# Altium project MiniPC MB GOST.PrjPcb (part 31 of 31)

## Sheet P_JTAG_EEPROM.SchDoc
size 420 x 297 mm; Author: ALTIUM GOSTBOM2.0 KEV; SheetNumber: 23; SheetTotal: 48
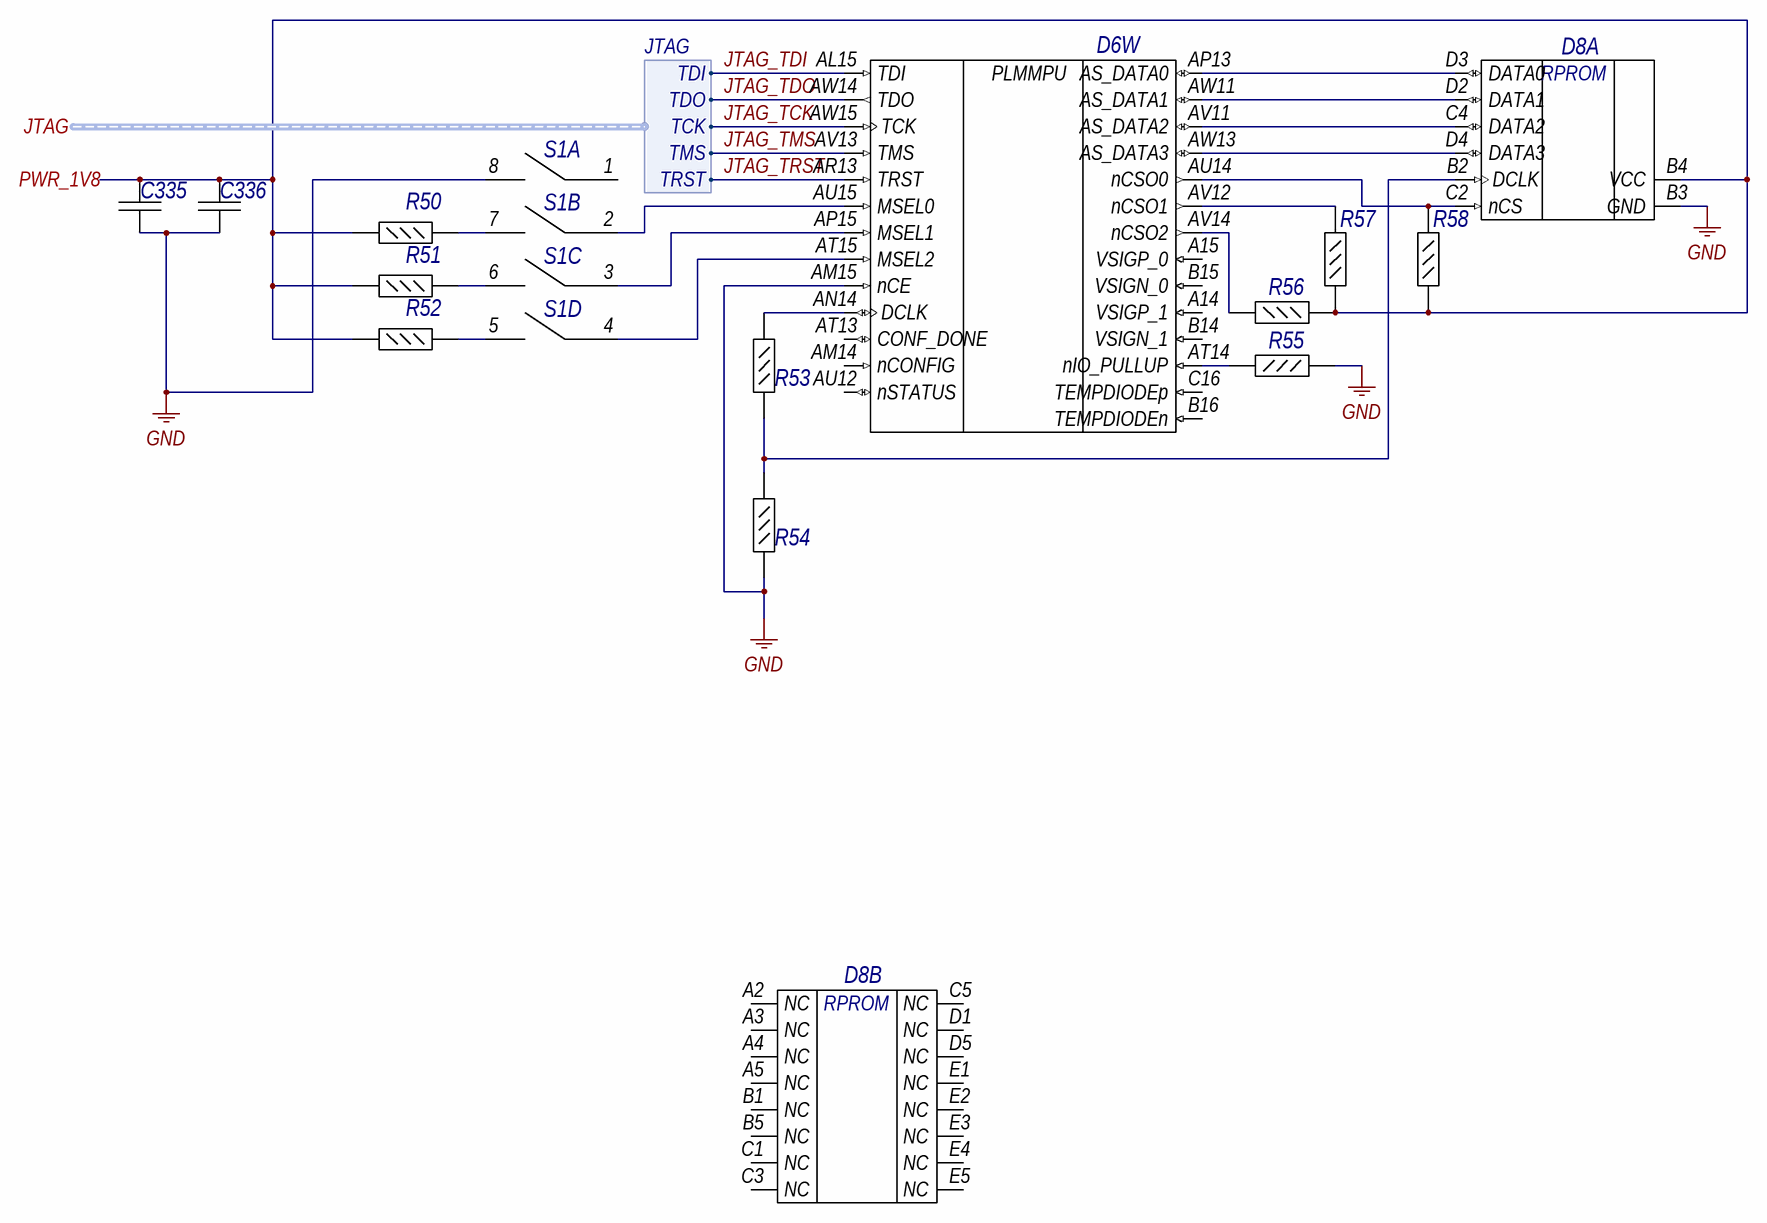
[diagram p40: P_JTAG_EEPROM.SchDoc]

### Parts
C335  C1005X7R1E104M  [CAPC1005X55X10LL05]  (value not drawn)
C336  C1005X7R1E104M  [CAPC1005X55X10LL05]  (value not drawn)
D6  10AS066N3F40E2SGE2  [ALTR-FBGA1517_A-350]  (value not drawn)  (part W of 39)
D8  EPCQL1024F24IN  [ALTR-FBGA24_A-130]  (value not drawn)  (parts A,B of 2)
R50  ERJ-2RKF1001X  [RESC1005X40X25LL05T05]  (value not drawn)
R51  ERJ-2RKF1001X  [RESC1005X40X25LL05T05]  (value not drawn)
R52  ERJ-2RKF1001X  [RESC1005X40X25LL05T05]  (value not drawn)
R53  ERJ-2RKF1002X  [RESC1005X40X25LL05T05]  (value not drawn)
R54  ERJ-2RKF1002X  [RESC1005X40X25LL05T05]  (value not drawn)
R55  ERJ-2GE0R00X  [RESC1005X40X25LL05T05]  (value not drawn)
R56  ERJ-2RKF1002X  [RESC1005X40X25LL05T05]  (value not drawn)
R57  ERJ-2RKF1002X  [RESC1005X40X25LL05T05]  (value not drawn)
R58  ERJ-2RKF1002X  [RESC1005X40X25LL05T05]  (value not drawn)
S1  416131160804  [416131160804]  (value not drawn)  (parts A,B,C,D of 4)

### Ports
JTAG (harness JTAG), PWR_1V8

### Harnesses
JTAG: TCK, TDO, TMS, TRST, TDI

### Nets
GND: C335.1 C336.1 D6.AM15(nCE) D8.B3(GND) R54.1 R55.1 S1.8
JTAG_TCK: D6.AW15(TCK) ; port JTAG.TCK
JTAG_TDI: D6.AL15(TDI) ; port JTAG.TDI
JTAG_TDO: D6.AW14(TDO) ; port JTAG.TDO
JTAG_TMS: D6.AV13(TMS) ; port JTAG.TMS
JTAG_TRST: D6.AR13(TRST) ; port JTAG.TRST
NetC335_2: C335.2 C336.2 D8.B4(VCC) R50.1 R51.1 R52.1 R56.1 R57.1 R58.1 ; port PWR_1V8
NetD6_AN14: D6.AN14(DCLK) R53.2
NetD6_AP13: D6.AP13(AS_DATA0) D8.D3(DATA0)
NetD6_AP15: D6.AP15(MSEL1) S1.3
NetD6_AT14: D6.AT14(nIO_PULLUP) R55.2
NetD6_AT15: D6.AT15(MSEL2) S1.4
NetD6_AU14: D6.AU14(nCSO0) D8.C2(nCS) R58.2
NetD6_AU15: D6.AU15(MSEL0) S1.2
NetD6_AV11: D6.AV11(AS_DATA2) D8.C4(DATA2)
NetD6_AV12: D6.AV12(nCSO1) R57.2
NetD6_AV14: D6.AV14(nCSO2) R56.2
NetD6_AW11: D6.AW11(AS_DATA1) D8.D2(DATA1)
NetD6_AW13: D6.AW13(AS_DATA3) D8.D4(DATA3)
NetD8_B2: D8.B2(DCLK) R53.1 R54.2
NetR50_2: R50.2 S1.7
NetR51_2: R51.2 S1.6
NetR52_2: R52.2 S1.5

Not connected (* = marked no-connect by the designer): D6 A14(VSIGP_1) A15(VSIGP_0) AM14(nCONFIG) AT13(CONF_DONE) AU12(nSTATUS) B14(VSIGN_1) B15(VSIGN_0) B16(TEMPDIODEn) C16(TEMPDIODEp); D8 A2(NC) A3(NC) A4(NC) A5(NC) B1(NC) B5(NC) C1(NC) C3(NC) C5(NC) D1(NC) D5(NC) E1(NC) E2(NC) E3(NC) E4(NC) E5(NC); S1 1

### Notes on the sheet
- Подп. дата
- Инв. № дубл.
- Взам. инв. №
- Подп. и дата
- Инв. № подл.
- Изм.
- Лист
- № докум.
- Подп.
- Дата
- ALTIUM GOSTBOM2.0 KEV
- Файл:
- Копировал
- Формат А3
- (in symbol E105, part W) PLMMPU
- (in symbol E121, part A) RPROM
- (in symbol E121, part B) RPROM

### Library data of the parts
C335 = E11: Chip Capacitor, 0.1 uF, +/- 20%, 25 V, -55 to 125 degC, 0402 (1005 Metric), RoHS, Tape and Reel; Тип элемента: Конденсатор; Capacitance: 100 nF; Case\/Package: 0402; Type (Capacitors): X7R; Voltage Rating: 25 V; Old_des: C388; New_des: C335; UID: E11; Component Kind: Standard; Case Code (Imperial): 0402; Case Code (Metric): 1005; ComponentLink1Description: Manufacturer URL; ComponentLink1URL: http://www.tdk.com/; ComponentLink2Description: Datasheet; ComponentLink2URL: http://www.farnell.com/datasheets/1571323.pdf; DatasheetVersion: 09/2011; Length: 1 mm; Max Operating Temperature: 125 degC; Min Operating Temperature: -55 degC; Mounting Technology: Surface Mount; Package Quantity: 10000; PackageDescription: 2-Pin Surface Mount Device, Body 1 x 0.5 mm; Packaging: Tape and Reel; PartNumber: C1005X7R1E104M; RoHSCompliant: true; Tolerance: 20%; Width: 0.5 mm; Height: 0.5 mm; Mount: Surface Mount; PackageReference: 0402; Pins: 2; Voltage Rating (DC): 25 V
C336 = E11: Chip Capacitor, 0.1 uF, +/- 20%, 25 V, -55 to 125 degC, 0402 (1005 Metric), RoHS, Tape and Reel; Тип элемента: Конденсатор; Capacitance: 100 nF; Case\/Package: 0402; Type (Capacitors): X7R; Voltage Rating: 25 V; Old_des: C389; New_des: C336; UID: E11; Component Kind: Standard; Case Code (Imperial): 0402; Case Code (Metric): 1005; ComponentLink1Description: Manufacturer URL; ComponentLink1URL: http://www.tdk.com/; ComponentLink2Description: Datasheet; ComponentLink2URL: http://www.farnell.com/datasheets/1571323.pdf; DatasheetVersion: 09/2011; Length: 1 mm; Max Operating Temperature: 125 degC; Min Operating Temperature: -55 degC; Mounting Technology: Surface Mount; Package Quantity: 10000; PackageDescription: 2-Pin Surface Mount Device, Body 1 x 0.5 mm; Packaging: Tape and Reel; PartNumber: C1005X7R1E104M; RoHSCompliant: true; Tolerance: 20%; Width: 0.5 mm; Height: 0.5 mm; Mount: Surface Mount; PackageReference: 0402; Pins: 2; Voltage Rating (DC): 25 V
D6 = E105: Arria 10 SX Family, 588 I/O Pins, 16 Fractional PLLs, 1517-Pin FBGA, Speed Grade 2, Extended Grade, RoHS; Тип элемента: ПЛИС; Old_des: U1; New_des: D6; UID: E105; Component Kind: Standard; ComponentLink1Description: Manufacturer URL; ComponentLink1URL: https://www.altera.com/; ComponentLink2Description: Datasheet; ComponentLink2URL: https://www.altera.com/content/dam/altera-www/global/en_US/pdfs/literature/hb/arria-10/a10_datasheet.pdf; DatasheetVersion: Rev. 2016-06-24, 06/2016; Mounting Technology: Surface Mount; PackageDescription: 1517-Pin FineLine Ball-Grid Array (FBGA), Body 40 x 40 mm, Pitch 1 mm; PartNumber: 10AS066N3F40E2SGE2; Code_JEDEC: MS-034; ComponentLink3Description: Package Specification; ComponentLink3URL: https://www.altera.com/content/dam/altera-www/global/en_US/pdfs/literature/packaging/04r00461-04.pdf; PackageVersion: Rev. 5.0, 01/2016
D8 = E121: EPCQ-L Serial Configuration Device, 1.8 V, -40 to 85 degC, 24-Pin FBGA, RoHS, Tray; Manufacturer: Altera; Тип элемента: ППЗУ; Old_des: U26; New_des: D8; UID: E121; Component Kind: Standard; ComponentLink1Description: Manufacturer URL; ComponentLink1URL: https://www.altera.com/; ComponentLink2Description: Datasheet; ComponentLink2URL: https://www.altera.com/content/dam/altera-www/global/en_US/pdfs/literature/hb/cfg/cfg_cf52013.pdf; DatasheetVersion: Rev. 2016-05-30; Mounting Technology: Surface Mount; PackageDescription: 24-Pin FineLine Ball-Grid Array, Body 6 x 8 mm, Pitch 1 mm; PartNumber: EPCQL1024F24IN; PackageReference: FBGA24_A-130; ComponentLink3Description: Package Specification; ComponentLink3URL: https://www.altera.com/content/dam/altera-www/global/en_US/pdfs/literature/packaging/04r00469-01.pdf; PackageVersion: Rev. 2.0, 01/2015
R50 = E59: Chip Resistor, 1 KOhm, +/- 1%, 100 mW, -55 to 155 degC, 0402 (1005 Metric), RoHS, Tape and Reel; Manufacturer: Basic Passives; Тип элемента: Резистор; Case\/Package: 0402; Voltage Rating: 50 V; Power Rating: 100 mW; Resistance: 1 KOhm; Old_des: R319; New_des: R50; UID: E59; Component Kind: Standard; Case Code (Imperial): 0402; Case Code (Metric): 1005; ComponentLink1Description: Manufacturer URL; ComponentLink1URL: http://www.panasonic.com/; ComponentLink2Description: Datasheet; ComponentLink2URL: http://industrial.panasonic.com/cdbs/www-data/pdf/RDA0000/AOA0000C86.pdf; DatasheetVersion: 04/2015; Length: 1 mm; Max Operating Temperature: 155 degC; Min Operating Temperature: -55 degC; Mounting Technology: Surface Mount; Package Quantity: 10000; PackageDescription: 2-Pin Surface Mount Device, Body 1 x 0.5 mm; Packaging: Tape and Reel; PartNumber: ERJ-2RKF1001X; RoHSCompliant: true; Tolerance: 1%; Width: 0.5 mm; Height: 0.35 mm; Mount: Surface Mount; PackageReference: 0402; Pins: 2; Radiation Hardening: No; REACH SVHC: Yes
R51 = E59: Chip Resistor, 1 KOhm, +/- 1%, 100 mW, -55 to 155 degC, 0402 (1005 Metric), RoHS, Tape and Reel; Manufacturer: Basic Passives; Тип элемента: Резистор; Case\/Package: 0402; Voltage Rating: 50 V; Power Rating: 100 mW; Resistance: 1 KOhm; Old_des: R318; New_des: R51; UID: E59; Component Kind: Standard; Case Code (Imperial): 0402; Case Code (Metric): 1005; ComponentLink1Description: Manufacturer URL; ComponentLink1URL: http://www.panasonic.com/; ComponentLink2Description: Datasheet; ComponentLink2URL: http://industrial.panasonic.com/cdbs/www-data/pdf/RDA0000/AOA0000C86.pdf; DatasheetVersion: 04/2015; Length: 1 mm; Max Operating Temperature: 155 degC; Min Operating Temperature: -55 degC; Mounting Technology: Surface Mount; Package Quantity: 10000; PackageDescription: 2-Pin Surface Mount Device, Body 1 x 0.5 mm; Packaging: Tape and Reel; PartNumber: ERJ-2RKF1001X; RoHSCompliant: true; Tolerance: 1%; Width: 0.5 mm; Height: 0.35 mm; Mount: Surface Mount; PackageReference: 0402; Pins: 2; Radiation Hardening: No; REACH SVHC: Yes
R52 = E59: Chip Resistor, 1 KOhm, +/- 1%, 100 mW, -55 to 155 degC, 0402 (1005 Metric), RoHS, Tape and Reel; Manufacturer: Basic Passives; Тип элемента: Резистор; Case\/Package: 0402; Voltage Rating: 50 V; Power Rating: 100 mW; Resistance: 1 KOhm; Old_des: R317; New_des: R52; UID: E59; Component Kind: Standard; Case Code (Imperial): 0402; Case Code (Metric): 1005; ComponentLink1Description: Manufacturer URL; ComponentLink1URL: http://www.panasonic.com/; ComponentLink2Description: Datasheet; ComponentLink2URL: http://industrial.panasonic.com/cdbs/www-data/pdf/RDA0000/AOA0000C86.pdf; DatasheetVersion: 04/2015; Length: 1 mm; Max Operating Temperature: 155 degC; Min Operating Temperature: -55 degC; Mounting Technology: Surface Mount; Package Quantity: 10000; PackageDescription: 2-Pin Surface Mount Device, Body 1 x 0.5 mm; Packaging: Tape and Reel; PartNumber: ERJ-2RKF1001X; RoHSCompliant: true; Tolerance: 1%; Width: 0.5 mm; Height: 0.35 mm; Mount: Surface Mount; PackageReference: 0402; Pins: 2; Radiation Hardening: No; REACH SVHC: Yes
R53 = E60: Chip Resistor, 10 KOhm, +/- 1%, 100 mW, -55 to 155 degC, 0402 (1005 Metric), RoHS, Tape and Reel; Manufacturer: Basic Passives; Тип элемента: Резистор; Case\/Package: 0402; Voltage Rating: 50 V; Power Rating: 100 mW; Resistance: 10 KOhm; Old_des: R320; New_des: R53; UID: E60; Component Kind: Standard; Case Code (Imperial): 0402; Case Code (Metric): 1005; ComponentLink1Description: Manufacturer URL; ComponentLink1URL: http://www.panasonic.com/; ComponentLink2Description: Datasheet; ComponentLink2URL: http://industrial.panasonic.com/cdbs/www-data/pdf/RDA0000/AOA0000C86.pdf; DatasheetVersion: 04/2015; Length: 1 mm; Max Operating Temperature: 155 degC; Min Operating Temperature: -55 degC; Mounting Technology: Surface Mount; Package Quantity: 10000; PackageDescription: 2-Pin Surface Mount Device, Body 1 x 0.5 mm; Packaging: Tape and Reel; PartNumber: ERJ-2RKF1002X; RoHSCompliant: true; Tolerance: 1%; Width: 0.5 mm; Height: 0.35 mm; Mount: Surface Mount; PackageReference: 0402; Pins: 2; Radiation Hardening: No; REACH SVHC: Yes
R54 = E60: Chip Resistor, 10 KOhm, +/- 1%, 100 mW, -55 to 155 degC, 0402 (1005 Metric), RoHS, Tape and Reel; Manufacturer: Basic Passives; Тип элемента: Резистор; Case\/Package: 0402; Voltage Rating: 50 V; Power Rating: 100 mW; Resistance: 10 KOhm; Old_des: R322; New_des: R54; UID: E60; Component Kind: Standard; Case Code (Imperial): 0402; Case Code (Metric): 1005; ComponentLink1Description: Manufacturer URL; ComponentLink1URL: http://www.panasonic.com/; ComponentLink2Description: Datasheet; ComponentLink2URL: http://industrial.panasonic.com/cdbs/www-data/pdf/RDA0000/AOA0000C86.pdf; DatasheetVersion: 04/2015; Length: 1 mm; Max Operating Temperature: 155 degC; Min Operating Temperature: -55 degC; Mounting Technology: Surface Mount; Package Quantity: 10000; PackageDescription: 2-Pin Surface Mount Device, Body 1 x 0.5 mm; Packaging: Tape and Reel; PartNumber: ERJ-2RKF1002X; RoHSCompliant: true; Tolerance: 1%; Width: 0.5 mm; Height: 0.35 mm; Mount: Surface Mount; PackageReference: 0402; Pins: 2; Radiation Hardening: No; REACH SVHC: Yes
R55 = E64: Chip Resistor, 0 mOhm, +/- 5%, 100 mW, -55 to 155 degC, 0402 (1005 Metric), RoHS, Tape and Reel; Manufacturer: Basic Passives; Тип элемента: Резистор; Case\/Package: 0402; Voltage Rating: 50 V; Power Rating: 100 mW; Resistance: 0 mOhm; Old_des: R323; New_des: R56; UID: E64; Component Kind: Standard; Case Code (Imperial): 0402; Case Code (Metric): 1005; ComponentLink1Description: Manufacturer URL; ComponentLink1URL: http://www.panasonic.com/; ComponentLink2Description: Datasheet; ComponentLink2URL: http://industrial.panasonic.com/cdbs/www-data/pdf/RDA0000/AOA0000C84.pdf; DatasheetVersion: 03/2015; Length: 1 mm; Max Operating Temperature: 155 degC; Min Operating Temperature: -55 degC; Mounting Technology: Surface Mount; Package Quantity: 10000; PackageDescription: 2-Pin Surface Mount Device, Body 1 x 0.5 mm; Packaging: Tape and Reel; PartNumber: ERJ-2GE0R00X; RoHSCompliant: true; Tolerance: 5%; Width: 0.5 mm; Height: 0.35 mm; Mount: Surface Mount; PackageReference: 0402; Pins: 2; Radiation Hardening: No; REACH SVHC: Unknown
R56 = E60: Chip Resistor, 10 KOhm, +/- 1%, 100 mW, -55 to 155 degC, 0402 (1005 Metric), RoHS, Tape and Reel; Manufacturer: Basic Passives; Тип элемента: Резистор; Case\/Package: 0402; Voltage Rating: 50 V; Power Rating: 100 mW; Resistance: 10 KOhm; Old_des: R325; New_des: R55; UID: E60; Component Kind: Standard; Case Code (Imperial): 0402; Case Code (Metric): 1005; ComponentLink1Description: Manufacturer URL; ComponentLink1URL: http://www.panasonic.com/; ComponentLink2Description: Datasheet; ComponentLink2URL: http://industrial.panasonic.com/cdbs/www-data/pdf/RDA0000/AOA0000C86.pdf; DatasheetVersion: 04/2015; Length: 1 mm; Max Operating Temperature: 155 degC; Min Operating Temperature: -55 degC; Mounting Technology: Surface Mount; Package Quantity: 10000; PackageDescription: 2-Pin Surface Mount Device, Body 1 x 0.5 mm; Packaging: Tape and Reel; PartNumber: ERJ-2RKF1002X; RoHSCompliant: true; Tolerance: 1%; Width: 0.5 mm; Height: 0.35 mm; Mount: Surface Mount; PackageReference: 0402; Pins: 2; Radiation Hardening: No; REACH SVHC: Yes
R57 = E60: Chip Resistor, 10 KOhm, +/- 1%, 100 mW, -55 to 155 degC, 0402 (1005 Metric), RoHS, Tape and Reel; Manufacturer: Basic Passives; Тип элемента: Резистор; Case\/Package: 0402; Voltage Rating: 50 V; Power Rating: 100 mW; Resistance: 10 KOhm; Old_des: R324; New_des: R57; UID: E60; Component Kind: Standard; Case Code (Imperial): 0402; Case Code (Metric): 1005; ComponentLink1Description: Manufacturer URL; ComponentLink1URL: http://www.panasonic.com/; ComponentLink2Description: Datasheet; ComponentLink2URL: http://industrial.panasonic.com/cdbs/www-data/pdf/RDA0000/AOA0000C86.pdf; DatasheetVersion: 04/2015; Length: 1 mm; Max Operating Temperature: 155 degC; Min Operating Temperature: -55 degC; Mounting Technology: Surface Mount; Package Quantity: 10000; PackageDescription: 2-Pin Surface Mount Device, Body 1 x 0.5 mm; Packaging: Tape and Reel; PartNumber: ERJ-2RKF1002X; RoHSCompliant: true; Tolerance: 1%; Width: 0.5 mm; Height: 0.35 mm; Mount: Surface Mount; PackageReference: 0402; Pins: 2; Radiation Hardening: No; REACH SVHC: Yes
R58 = E60: Chip Resistor, 10 KOhm, +/- 1%, 100 mW, -55 to 155 degC, 0402 (1005 Metric), RoHS, Tape and Reel; Manufacturer: Basic Passives; Тип элемента: Резистор; Case\/Package: 0402; Voltage Rating: 50 V; Power Rating: 100 mW; Resistance: 10 KOhm; Old_des: R321; New_des: R58; UID: E60; Component Kind: Standard; Case Code (Imperial): 0402; Case Code (Metric): 1005; ComponentLink1Description: Manufacturer URL; ComponentLink1URL: http://www.panasonic.com/; ComponentLink2Description: Datasheet; ComponentLink2URL: http://industrial.panasonic.com/cdbs/www-data/pdf/RDA0000/AOA0000C86.pdf; DatasheetVersion: 04/2015; Length: 1 mm; Max Operating Temperature: 155 degC; Min Operating Temperature: -55 degC; Mounting Technology: Surface Mount; Package Quantity: 10000; PackageDescription: 2-Pin Surface Mount Device, Body 1 x 0.5 mm; Packaging: Tape and Reel; PartNumber: ERJ-2RKF1002X; RoHSCompliant: true; Tolerance: 1%; Width: 0.5 mm; Height: 0.35 mm; Mount: Surface Mount; PackageReference: 0402; Pins: 2; Radiation Hardening: No; REACH SVHC: Yes
S1 = E104: WS-DISV 1.27 mm small compact SMD Dip Switch with top tape; Manufacturer: Wuerth Elektronik; Тип элемента: Набор 8 ключей; NoPins: 08; Old_des: SW2; New_des: S1; UID: E104; Component Kind: Standard; ComponentLink1Description: Manufacturer URL; ComponentLink1URL: http://www.we-online.com; ComponentLink2Description: Datasheet; ComponentLink2URL: http://katalog.we-online.de/em/datasheet/4161311608xx.pdf; PartNumber: 416131160804; PackageReference: 416131160804

## Sheet P_USB.SchDoc
size 209 x 297 mm; Author: ALTIUM GOSTBOM2.0 KEV; SheetNumber: 29; SheetTotal: 48
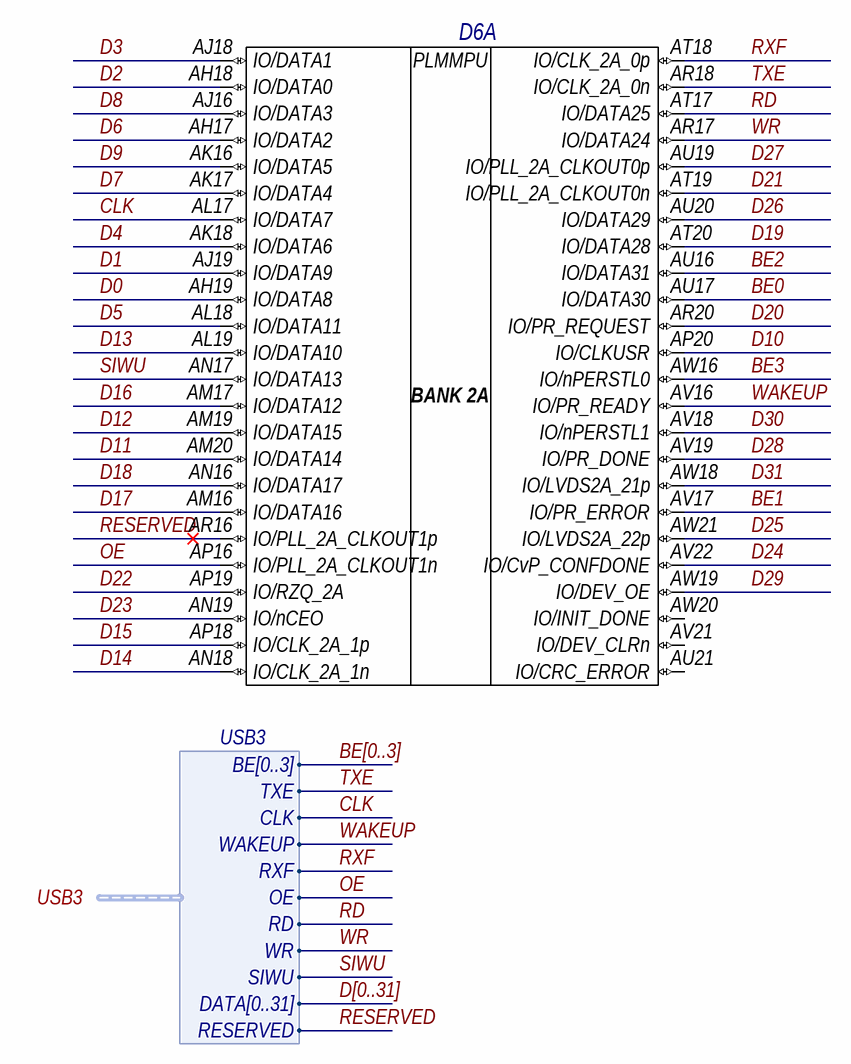
[diagram p41: P_USB.SchDoc]

### Parts
D6  10AS066N3F40E2SGE2  [ALTR-FBGA1517_A-350]  (value not drawn)  (part A of 39)

### Ports
USB3 (harness USB3)

### Harnesses
USB3: BE[0..3], TXE, CLK, WAKEUP, RXF, OE, RD, WR, SIWU, DATA[0..31], RESERVED

### Nets
BE0: D6.AU17(IO/DATA30)  [project net BE0_29]
BE1: D6.AV17(IO/PR_ERROR)  [project net BE1_29]
BE2: D6.AU16(IO/DATA31)  [project net BE2_29]
BE3: D6.AW16(IO/nPERSTL0)  [project net BE3_29]
CLK: D6.AL17(IO/DATA7) ; port USB3.CLK
D0: D6.AH19(IO/DATA8)  [project net D0_29]
D1: D6.AJ19(IO/DATA9)  [project net D1_29]
D2: D6.AH18(IO/DATA0)  [project net D2_29]
D3: D6.AJ18(IO/DATA1)  [project net D3_29]
D4: D6.AK18(IO/DATA6)  [project net D4_29]
D5: D6.AL18(IO/DATA11)  [project net D5_29]
D6: D6.AH17(IO/DATA2)  [project net D6_29]
D7: D6.AK17(IO/DATA4)  [project net D7_29]
D8: D6.AJ16(IO/DATA3)  [project net D8_29]
D9: D6.AK16(IO/DATA5)  [project net D9_29]
D10: D6.AP20(IO/CLKUSR)  [project net D10_29]
D11: D6.AM20(IO/DATA14)  [project net D11_29]
D12: D6.AM19(IO/DATA15)  [project net D12_29]
D13: D6.AL19(IO/DATA10)  [project net D13_29]
D14: D6.AN18(IO/CLK_2A_1n)  [project net D14_29]
D15: D6.AP18(IO/CLK_2A_1p)  [project net D15_29]
D16: D6.AM17(IO/DATA12)  [project net D16_29]
D17: D6.AM16(IO/DATA16)  [project net D17_29]
D18: D6.AN16(IO/DATA17)  [project net D18_29]
D19: D6.AT20(IO/DATA28)  [project net D19_29]
D20: D6.AR20(IO/PR_REQUEST)  [project net D20_29]
D21: D6.AT19(IO/PLL_2A_CLKOUT0n)  [project net D21_29]
D22: D6.AP19(IO/RZQ_2A)  [project net D22_29]
D23: D6.AN19(IO/nCEO)  [project net D23_29]
D24: D6.AV22(IO/CvP_CONFDONE)  [project net D24_29]
D25: D6.AW21(IO/LVDS2A_22p)  [project net D25_29]
D26: D6.AU20(IO/DATA29)  [project net D26_29]
D27: D6.AU19(IO/PLL_2A_CLKOUT0p)  [project net D27_29]
D28: D6.AV19(IO/PR_DONE)  [project net D28_29]
D29: D6.AW19(IO/DEV_OE)  [project net D29_29]
D30: D6.AV18(IO/nPERSTL1)  [project net D30_29]
D31: D6.AW18(IO/LVDS2A_21p)  [project net D31_29]
OE: D6.AP16(IO/PLL_2A_CLKOUT1n) ; port USB3.OE
RD: D6.AT17(IO/DATA25) ; port USB3.RD
RESERVED: D6.AR16(IO/PLL_2A_CLKOUT1p) ; port USB3.RESERVED
RXF: D6.AT18(IO/CLK_2A_0p) ; port USB3.RXF
SIWU: D6.AN17(IO/DATA13) ; port USB3.SIWU
TXE: D6.AR18(IO/CLK_2A_0n) ; port USB3.TXE
WAKEUP: D6.AV16(IO/PR_READY) ; port USB3.WAKEUP
WR: D6.AR17(IO/DATA24) ; port USB3.WR

Not connected (* = marked no-connect by the designer): D6 AU21(IO/CRC_ERROR) AV21(IO/DEV_CLRn) AW20(IO/INIT_DONE)

### Buses and harness runs
bus BE[0..3]
bus D[0..31]

### Notes on the sheet
- Подп. дата
- Инв. № дубл.
- Взам. инв. №
- Подп. и дата
- Инв. № подл.
- Изм.
- Лист
- № докум.
- Подп.
- Дата
- Файл:
- ALTIUM GOSTBOM2.0 KEV
- Копировал
- Формат А4
- (in symbol E105, part A) PLMMPU; BANK 2A

### Library data of the parts
D6 = E105: as D6 on sheet P_JTAG_EEPROM; UID: E105; Component Kind: Standard; ComponentLink1Description: Manufacturer URL; ComponentLink1URL: https://www.altera.com/; ComponentLink2Description: Datasheet; ComponentLink2URL: https://www.altera.com/content/dam/altera-www/global/en_US/pdfs/literature/hb/arria-10/a10_datasheet.pdf; PartNumber: 10AS066N3F40E2SGE2; DatasheetVersion: Rev. 2016-06-24, 06/2016; Mounting Technology: Surface Mount; PackageDescription: 1517-Pin FineLine Ball-Grid Array (FBGA), Body 40 x 40 mm, Pitch 1 mm; Code_JEDEC: MS-034; ComponentLink3Description: Package Specification; ComponentLink3URL: https://www.altera.com/content/dam/altera-www/global/en_US/pdfs/literature/packaging/04r00461-04.pdf; PackageVersion: Rev. 5.0, 01/2016

## Sheet P_MiniPCIE.SchDoc
size 209 x 297 mm; Author: ALTIUM GOSTBOM2.0 KEV; SheetNumber: 24; SheetTotal: 48
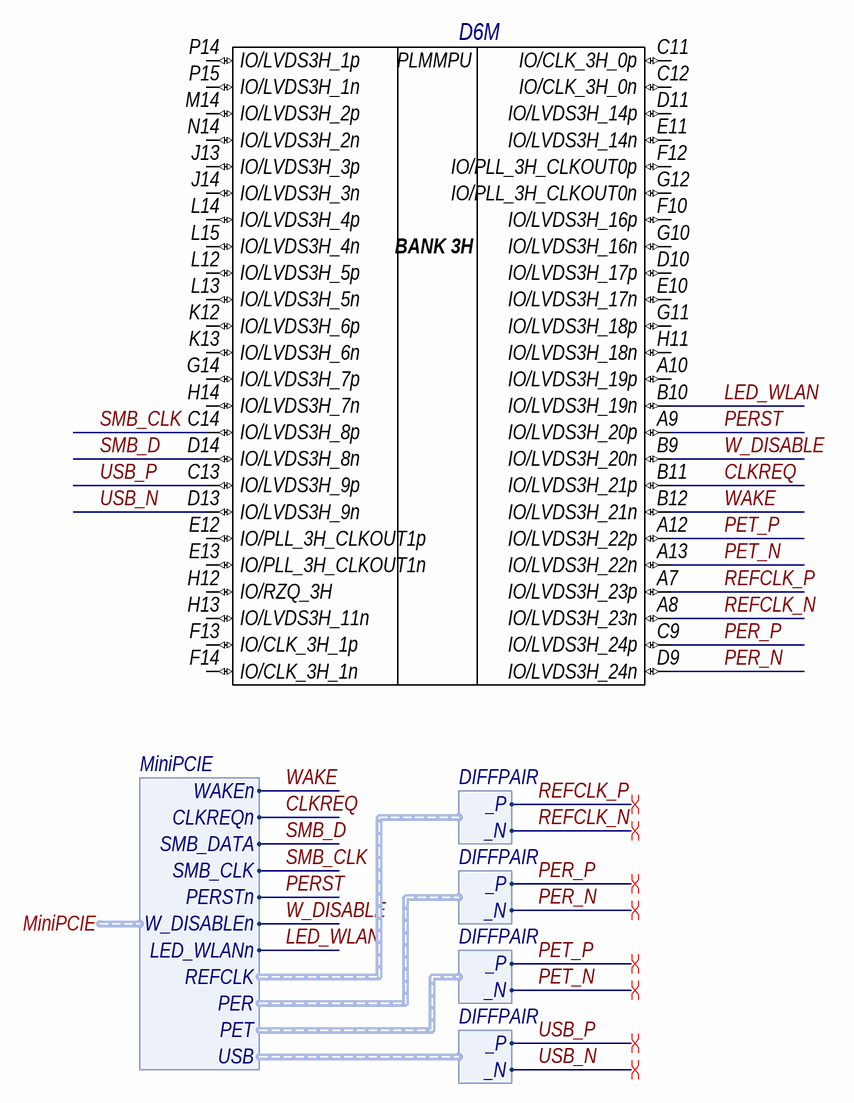
[diagram p42: P_MiniPCIE.SchDoc]

### Parts
D6  10AS066N3F40E2SGE2  [ALTR-FBGA1517_A-350]  (value not drawn)  (part M of 39)

### Ports
MiniPCIE (harness MiniPCIE)

### Harnesses
MiniPCIE: WAKEn, CLKREQn, SMB_DATA, SMB_CLK, PERSTn, W_DISABLEn, LED_WLANn, REFCLK, PER, PET, USB
DIFFPAIR: _P, _N

### Nets
CLKREQ: D6.B11(IO/LVDS3H_21p) ; port MiniPCIE.CLKREQn
LED_WLAN: D6.B10(IO/LVDS3H_19n) ; port MiniPCIE.LED_WLANn
PER_N: D6.D9(IO/LVDS3H_24n) ; harness DIFFPAIR._N
PER_P: D6.C9(IO/LVDS3H_24p) ; harness DIFFPAIR._P
PERST: D6.A9(IO/LVDS3H_20p) ; port MiniPCIE.PERSTn
PET_N: D6.A13(IO/LVDS3H_22n) ; harness DIFFPAIR._N
PET_P: D6.A12(IO/LVDS3H_22p) ; harness DIFFPAIR._P
REFCLK_N: D6.A8(IO/LVDS3H_23n) ; harness DIFFPAIR._N
REFCLK_P: D6.A7(IO/LVDS3H_23p) ; harness DIFFPAIR._P
SMB_CLK: D6.C14(IO/LVDS3H_8p) ; port MiniPCIE.SMB_CLK
SMB_D: D6.D14(IO/LVDS3H_8n) ; port MiniPCIE.SMB_DATA
USB_N: D6.D13(IO/LVDS3H_9n) ; harness DIFFPAIR._N
USB_P: D6.C13(IO/LVDS3H_9p) ; harness DIFFPAIR._P
W_DISABLE: D6.B9(IO/LVDS3H_20n) ; port MiniPCIE.W_DISABLEn
WAKE: D6.B12(IO/LVDS3H_21n) ; port MiniPCIE.WAKEn

Not connected (* = marked no-connect by the designer): D6 A10(IO/LVDS3H_19p) C11(IO/CLK_3H_0p) C12(IO/CLK_3H_0n) D10(IO/LVDS3H_17p) D11(IO/LVDS3H_14p) E10(IO/LVDS3H_17n) E11(IO/LVDS3H_14n) E12(IO/PLL_3H_CLKOUT1p) E13(IO/PLL_3H_CLKOUT1n) F10(IO/LVDS3H_16p) F12(IO/PLL_3H_CLKOUT0p) F13(IO/CLK_3H_1p) F14(IO/CLK_3H_1n) G10(IO/LVDS3H_16n) G11(IO/LVDS3H_18p) G12(IO/PLL_3H_CLKOUT0n) G14(IO/LVDS3H_7p) H11(IO/LVDS3H_18n) H12(IO/RZQ_3H) H13(IO/LVDS3H_11n) H14(IO/LVDS3H_7n) J13(IO/LVDS3H_3p) J14(IO/LVDS3H_3n) K12(IO/LVDS3H_6p) K13(IO/LVDS3H_6n) L12(IO/LVDS3H_5p) L13(IO/LVDS3H_5n) L14(IO/LVDS3H_4p) L15(IO/LVDS3H_4n) M14(IO/LVDS3H_2p) N14(IO/LVDS3H_2n) P14(IO/LVDS3H_1p) P15(IO/LVDS3H_1n)

### Layout directives
differential pair: PER_N, PER_P, PET_N, PET_P, REFCLK_N, REFCLK_P, USB_N, USB_P

### Notes on the sheet
- Подп. дата
- Инв. № дубл.
- Взам. инв. №
- Подп. и дата
- Инв. № подл.
- Изм.
- Лист
- № докум.
- Подп.
- Дата
- Файл:
- ALTIUM GOSTBOM2.0 KEV
- Копировал
- Формат А4
- (in symbol E105, part M) PLMMPU; BANK 3H

### Library data of the parts
D6 = E105: as D6 on sheet P_JTAG_EEPROM; UID: E105; Component Kind: Standard; ComponentLink1Description: Manufacturer URL; ComponentLink1URL: https://www.altera.com/; ComponentLink2Description: Datasheet; ComponentLink2URL: https://www.altera.com/content/dam/altera-www/global/en_US/pdfs/literature/hb/arria-10/a10_datasheet.pdf; DatasheetVersion: Rev. 2016-06-24, 06/2016; Mounting Technology: Surface Mount; PackageDescription: 1517-Pin FineLine Ball-Grid Array (FBGA), Body 40 x 40 mm, Pitch 1 mm; PartNumber: 10AS066N3F40E2SGE2; Code_JEDEC: MS-034; ComponentLink3Description: Package Specification; ComponentLink3URL: https://www.altera.com/content/dam/altera-www/global/en_US/pdfs/literature/packaging/04r00461-04.pdf; PackageVersion: Rev. 5.0, 01/2016

## Sheet P_PCIE_ETH.SchDoc
size 420 x 297 mm; Author: ALTIUM GOSTBOM2.0 KEV; SheetNumber: 25; SheetTotal: 48
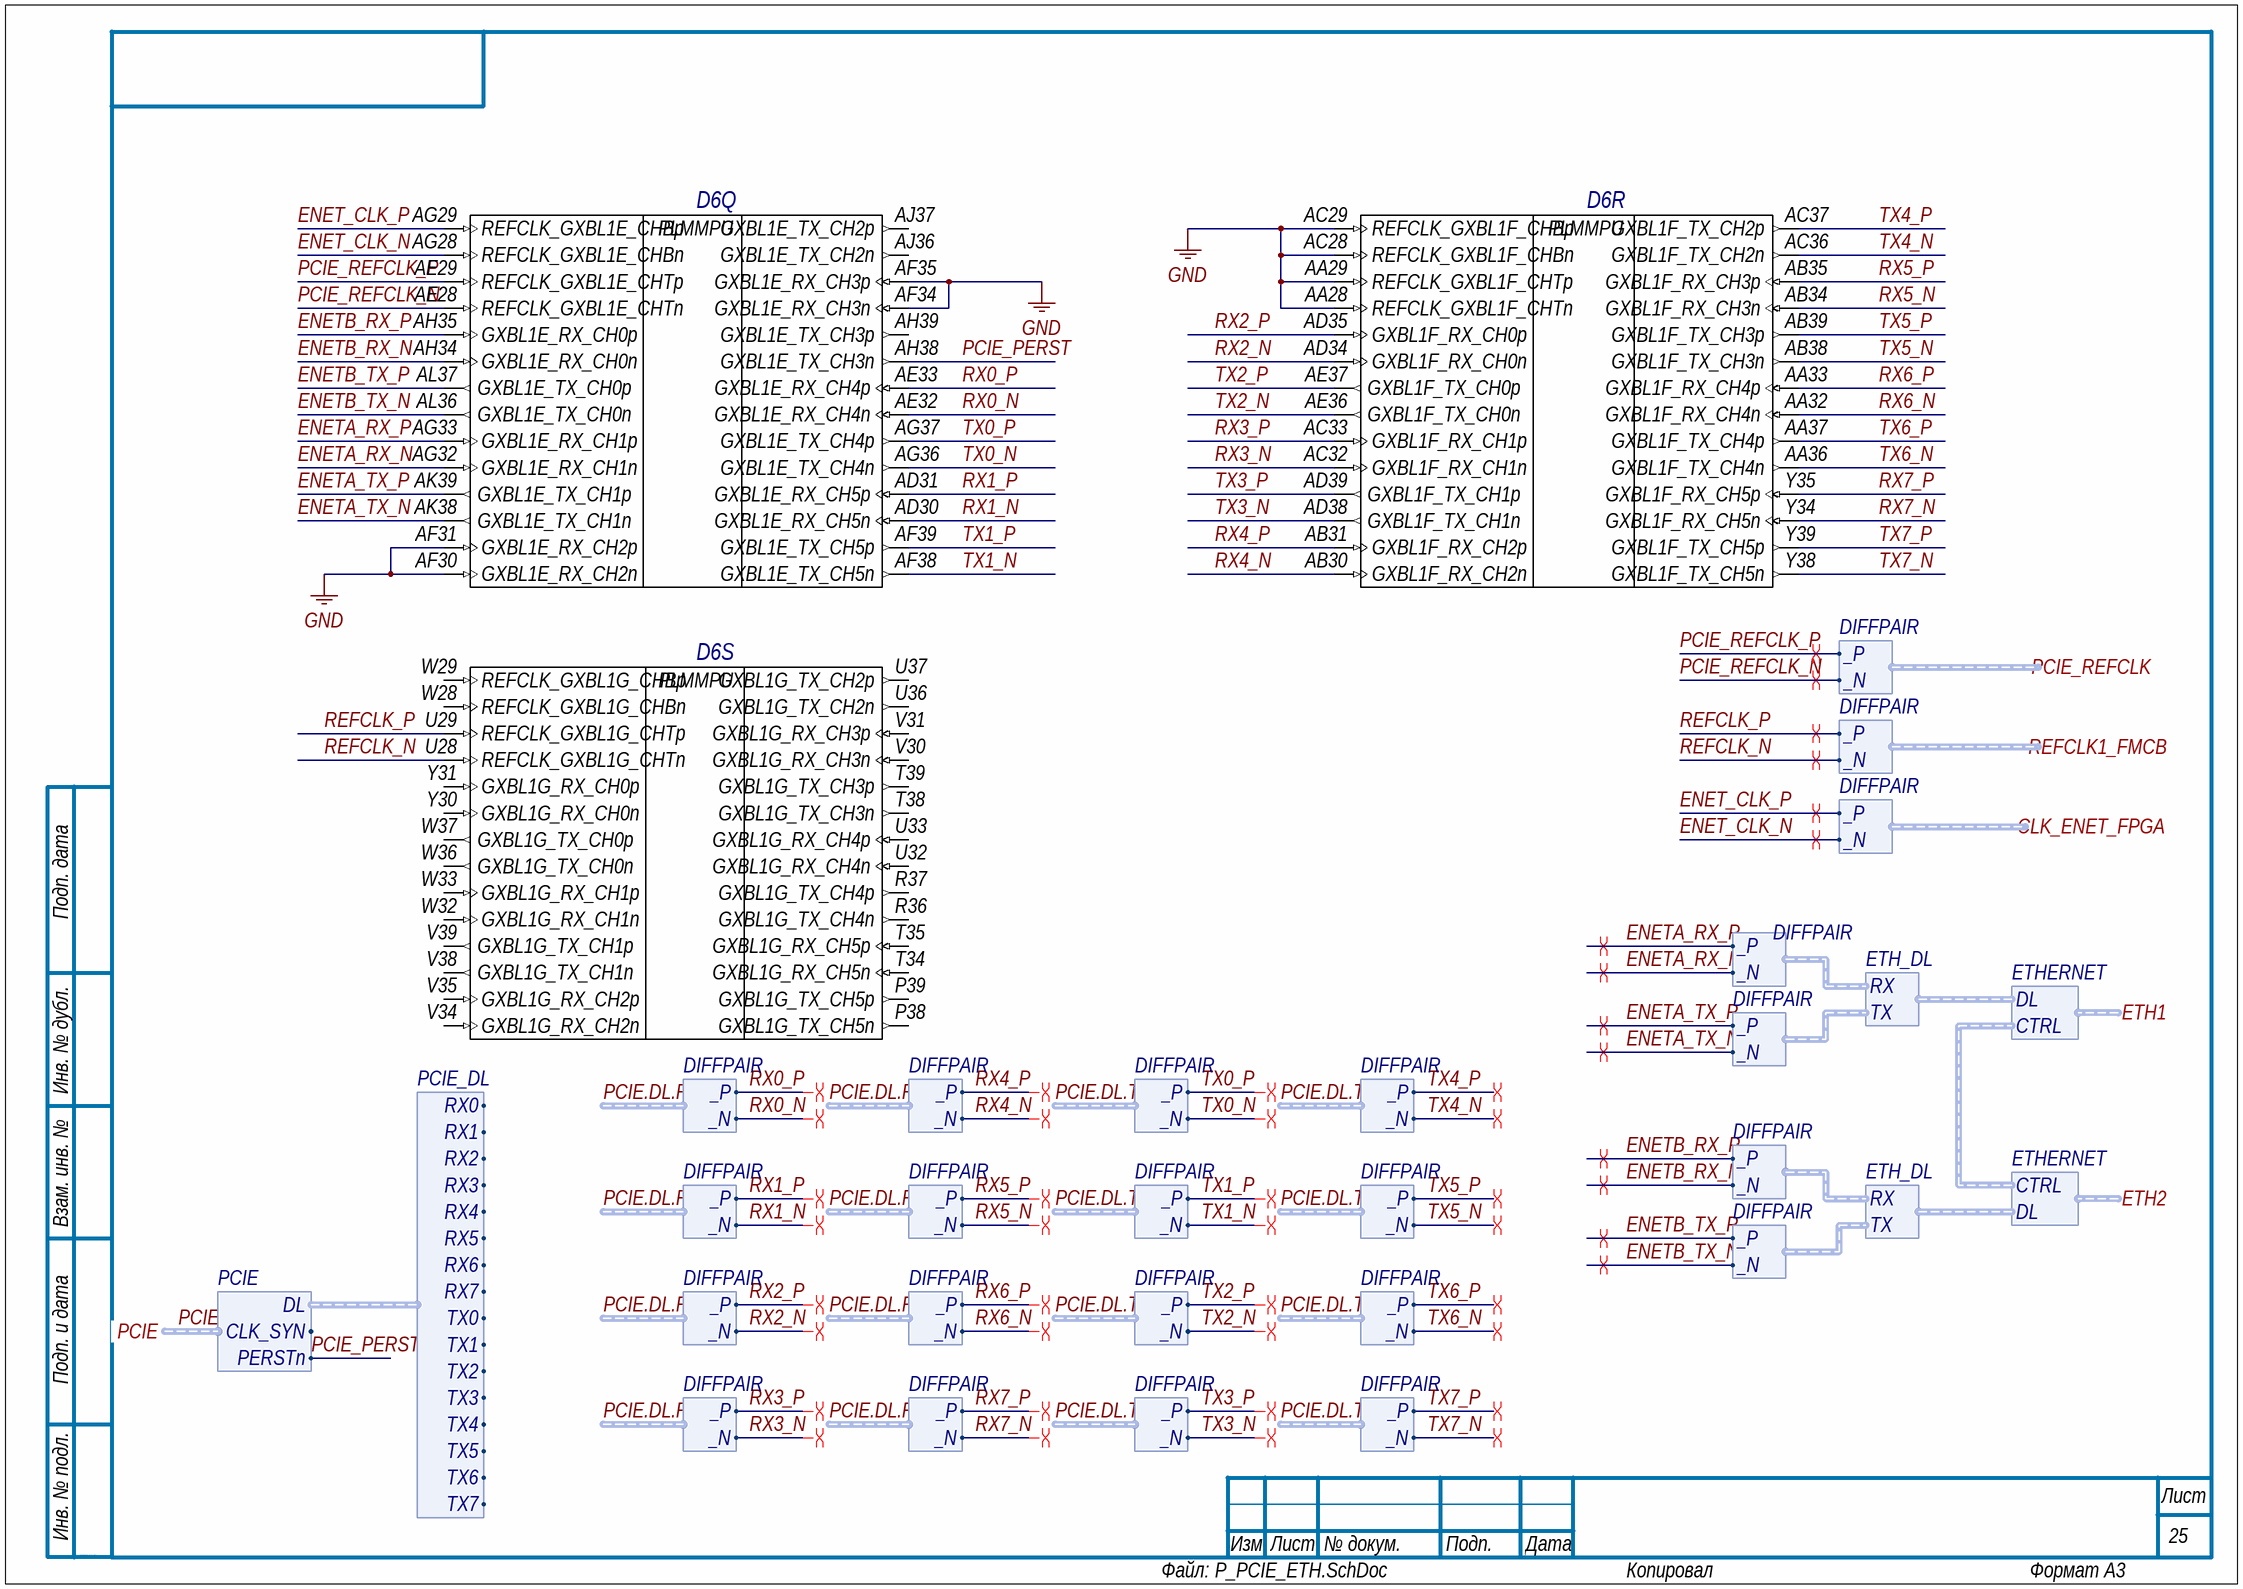
[diagram p43: P_PCIE_ETH.SchDoc]

### Parts
D6  10AS066N3F40E2SGE2  [ALTR-FBGA1517_A-350]  (value not drawn)  (parts Q,R,S of 39)

### Ports
CLK_ENET_FPGA (harness DIFFPAIR), ETH1 (harness ETHERNET), ETH2 (harness ETHERNET), PCIE (harness PCIE), PCIE_REFCLK (harness DIFFPAIR), REFCLK1_FMCB (harness DIFFPAIR)

### Harnesses
ETHERNET: DL, CTRL
ETH_DL: RX, TX
DIFFPAIR: _P, _N
PCIE: DL, CLK_SYN, PERSTn
PCIE_DL: RX0, RX1, RX2, RX3, RX4, RX5, RX6, RX7, TX0, TX1, TX2, TX3, TX4, TX5, TX6, TX7

### Nets
GND: D6.AA28(REFCLK_GXBL1F_CHTn) D6.AA29(REFCLK_GXBL1F_CHTp) D6.AC28(REFCLK_GXBL1F_CHBn) D6.AC29(REFCLK_GXBL1F_CHBp) D6.AF30(GXBL1E_RX_CH2n) D6.AF31(GXBL1E_RX_CH2p) D6.AF34(GXBL1E_RX_CH3n) D6.AF35(GXBL1E_RX_CH3p)
ENET_CLK_N: D6.AG28(REFCLK_GXBL1E_CHBn) ; port CLK_ENET_FPGA._N
ENET_CLK_P: D6.AG29(REFCLK_GXBL1E_CHBp) ; port CLK_ENET_FPGA._P
ENETA_RX_N: D6.AG32(GXBL1E_RX_CH1n) ; harness DIFFPAIR._N
ENETA_RX_P: D6.AG33(GXBL1E_RX_CH1p) ; harness DIFFPAIR._P
ENETA_TX_N: D6.AK38(GXBL1E_TX_CH1n) ; harness DIFFPAIR._N
ENETA_TX_P: D6.AK39(GXBL1E_TX_CH1p) ; harness DIFFPAIR._P
ENETB_RX_N: D6.AH34(GXBL1E_RX_CH0n) ; harness DIFFPAIR._N
ENETB_RX_P: D6.AH35(GXBL1E_RX_CH0p) ; harness DIFFPAIR._P
ENETB_TX_N: D6.AL36(GXBL1E_TX_CH0n) ; harness DIFFPAIR._N
ENETB_TX_P: D6.AL37(GXBL1E_TX_CH0p) ; harness DIFFPAIR._P
PCIE_PERST: D6.AH38(GXBL1E_TX_CH3n) ; port PCIE.PERSTn  [project net PCIE.PERSTn]
PCIE_REFCLK_N: D6.AE28(REFCLK_GXBL1E_CHTn) ; port PCIE_REFCLK._N
PCIE_REFCLK_P: D6.AE29(REFCLK_GXBL1E_CHTp) ; port PCIE_REFCLK._P
REFCLK_N: D6.U28(REFCLK_GXBL1G_CHTn) ; port REFCLK1_FMCB._N
REFCLK_P: D6.U29(REFCLK_GXBL1G_CHTp) ; port REFCLK1_FMCB._P
RX0_N: D6.AE32(GXBL1E_RX_CH4n) ; harness DIFFPAIR._N  [project net PCIE.DL.RX0._N]
RX0_P: D6.AE33(GXBL1E_RX_CH4p) ; harness DIFFPAIR._P  [project net PCIE.DL.RX0._P]
RX1_N: D6.AD30(GXBL1E_RX_CH5n) ; harness DIFFPAIR._N  [project net PCIE.DL.RX1._N]
RX1_P: D6.AD31(GXBL1E_RX_CH5p) ; harness DIFFPAIR._P  [project net PCIE.DL.RX1._P]
RX2_N: D6.AD34(GXBL1F_RX_CH0n) ; harness DIFFPAIR._N  [project net PCIE.DL.RX2._N]
RX2_P: D6.AD35(GXBL1F_RX_CH0p) ; harness DIFFPAIR._P  [project net PCIE.DL.RX2._P]
RX3_N: D6.AC32(GXBL1F_RX_CH1n) ; harness DIFFPAIR._N  [project net PCIE.DL.RX3._N]
RX3_P: D6.AC33(GXBL1F_RX_CH1p) ; harness DIFFPAIR._P  [project net PCIE.DL.RX3._P]
RX4_N: D6.AB30(GXBL1F_RX_CH2n) ; harness DIFFPAIR._N  [project net PCIE.DL.RX4._N]
RX4_P: D6.AB31(GXBL1F_RX_CH2p) ; harness DIFFPAIR._P  [project net PCIE.DL.RX4._P]
RX5_N: D6.AB34(GXBL1F_RX_CH3n) ; harness DIFFPAIR._N  [project net PCIE.DL.RX5._N]
RX5_P: D6.AB35(GXBL1F_RX_CH3p) ; harness DIFFPAIR._P  [project net PCIE.DL.RX5._P]
RX6_N: D6.AA32(GXBL1F_RX_CH4n) ; harness DIFFPAIR._N  [project net PCIE.DL.RX6._N]
RX6_P: D6.AA33(GXBL1F_RX_CH4p) ; harness DIFFPAIR._P  [project net PCIE.DL.RX6._P]
RX7_N: D6.Y34(GXBL1F_RX_CH5n) ; harness DIFFPAIR._N  [project net PCIE.DL.RX7._N]
RX7_P: D6.Y35(GXBL1F_RX_CH5p) ; harness DIFFPAIR._P  [project net PCIE.DL.RX7._P]
TX0_N: D6.AG36(GXBL1E_TX_CH4n) ; harness DIFFPAIR._N  [project net PCIE.DL.TX0._N]
TX0_P: D6.AG37(GXBL1E_TX_CH4p) ; harness DIFFPAIR._P  [project net PCIE.DL.TX0._P]
TX1_N: D6.AF38(GXBL1E_TX_CH5n) ; harness DIFFPAIR._N  [project net PCIE.DL.TX1._N]
TX1_P: D6.AF39(GXBL1E_TX_CH5p) ; harness DIFFPAIR._P  [project net PCIE.DL.TX1._P]
TX2_N: D6.AE36(GXBL1F_TX_CH0n) ; harness DIFFPAIR._N  [project net PCIE.DL.TX2._N]
TX2_P: D6.AE37(GXBL1F_TX_CH0p) ; harness DIFFPAIR._P  [project net PCIE.DL.TX2._P]
TX3_N: D6.AD38(GXBL1F_TX_CH1n) ; harness DIFFPAIR._N  [project net PCIE.DL.TX3._N]
TX3_P: D6.AD39(GXBL1F_TX_CH1p) ; harness DIFFPAIR._P  [project net PCIE.DL.TX3._P]
TX4_N: D6.AC36(GXBL1F_TX_CH2n) ; harness DIFFPAIR._N  [project net PCIE.DL.TX4._N]
TX4_P: D6.AC37(GXBL1F_TX_CH2p) ; harness DIFFPAIR._P  [project net PCIE.DL.TX4._P]
TX5_N: D6.AB38(GXBL1F_TX_CH3n) ; harness DIFFPAIR._N  [project net PCIE.DL.TX5._N]
TX5_P: D6.AB39(GXBL1F_TX_CH3p) ; harness DIFFPAIR._P  [project net PCIE.DL.TX5._P]
TX6_N: D6.AA36(GXBL1F_TX_CH4n) ; harness DIFFPAIR._N  [project net PCIE.DL.TX6._N]
TX6_P: D6.AA37(GXBL1F_TX_CH4p) ; harness DIFFPAIR._P  [project net PCIE.DL.TX6._P]
TX7_N: D6.Y38(GXBL1F_TX_CH5n) ; harness DIFFPAIR._N  [project net PCIE.DL.TX7._N]
TX7_P: D6.Y39(GXBL1F_TX_CH5p) ; harness DIFFPAIR._P  [project net PCIE.DL.TX7._P]

Not connected (* = marked no-connect by the designer): D6 AH39(GXBL1E_TX_CH3p) AJ36(GXBL1E_TX_CH2n) AJ37(GXBL1E_TX_CH2p) P38(GXBL1G_TX_CH5n) P39(GXBL1G_TX_CH5p) R36(GXBL1G_TX_CH4n) R37(GXBL1G_TX_CH4p) T34(GXBL1G_RX_CH5n) T35(GXBL1G_RX_CH5p) T38(GXBL1G_TX_CH3n) T39(GXBL1G_TX_CH3p) U32(GXBL1G_RX_CH4n) U33(GXBL1G_RX_CH4p) U36(GXBL1G_TX_CH2n) U37(GXBL1G_TX_CH2p) V30(GXBL1G_RX_CH3n) V31(GXBL1G_RX_CH3p) V34(GXBL1G_RX_CH2n) V35(GXBL1G_RX_CH2p) V38(GXBL1G_TX_CH1n) V39(GXBL1G_TX_CH1p) W28(REFCLK_GXBL1G_CHBn) W29(REFCLK_GXBL1G_CHBp) W32(GXBL1G_RX_CH1n) W33(GXBL1G_RX_CH1p) W36(GXBL1G_TX_CH0n) W37(GXBL1G_TX_CH0p) Y30(GXBL1G_RX_CH0n) Y31(GXBL1G_RX_CH0p)

### Buses and harness runs
harness PCIE = port PCIE

### Layout directives
differential pair: ENET_CLK_N, ENET_CLK_P, ENETA_RX_N, ENETA_RX_P, ENETA_TX_N, ENETA_TX_P, ENETB_RX_N, ENETB_RX_P, ENETB_TX_N, ENETB_TX_P, PCIE.DL.RX0._N, PCIE.DL.RX0._P, PCIE.DL.RX1._N, PCIE.DL.RX1._P, PCIE.DL.RX2._N, PCIE.DL.RX2._P, PCIE.DL.RX3._N, PCIE.DL.RX3._P, PCIE.DL.RX4._N, PCIE.DL.RX4._P, PCIE.DL.RX5._N, PCIE.DL.RX5._P, PCIE.DL.RX6._N, PCIE.DL.RX6._P, PCIE.DL.RX7._N, PCIE.DL.RX7._P, PCIE.DL.TX0._N, PCIE.DL.TX0._P, PCIE.DL.TX1._N, PCIE.DL.TX1._P, PCIE.DL.TX2._N, PCIE.DL.TX2._P, PCIE.DL.TX3._N, PCIE.DL.TX3._P, PCIE.DL.TX4._N, PCIE.DL.TX4._P, PCIE.DL.TX5._N, PCIE.DL.TX5._P, PCIE.DL.TX6._N, PCIE.DL.TX6._P, PCIE.DL.TX7._N, PCIE.DL.TX7._P, PCIE_REFCLK_N, PCIE_REFCLK_P, REFCLK_N, REFCLK_P

### Notes on the sheet
- Подп. дата
- Инв. № дубл.
- Взам. инв. №
- Подп. и дата
- Инв. № подл.
- Изм.
- Лист
- № докум.
- Подп.
- Дата
- ALTIUM GOSTBOM2.0 KEV
- Файл:
- Копировал
- Формат А3
- (in symbol E105, part Q) PLMMPU
- (in symbol E105, part R) PLMMPU
- (in symbol E105, part S) PLMMPU

### Library data of the parts
D6 = E105: as D6 on sheet P_JTAG_EEPROM; UID: E105; Component Kind: Standard; ComponentLink1Description: Manufacturer URL; ComponentLink1URL: https://www.altera.com/; ComponentLink2Description: Datasheet; ComponentLink2URL: https://www.altera.com/content/dam/altera-www/global/en_US/pdfs/literature/hb/arria-10/a10_datasheet.pdf; DatasheetVersion: Rev. 2016-06-24, 06/2016; Mounting Technology: Surface Mount; PackageDescription: 1517-Pin FineLine Ball-Grid Array (FBGA), Body 40 x 40 mm, Pitch 1 mm; PartNumber: 10AS066N3F40E2SGE2; Code_JEDEC: MS-034; ComponentLink3Description: Package Specification; ComponentLink3URL: https://www.altera.com/content/dam/altera-www/global/en_US/pdfs/literature/packaging/04r00461-04.pdf; PackageVersion: Rev. 5.0, 01/2016

## Sheet P_ETH_HPS.SchDoc
size 209 x 297 mm; Author: ALTIUM GOSTBOM2.0 KEV; SheetNumber: 21; SheetTotal: 48
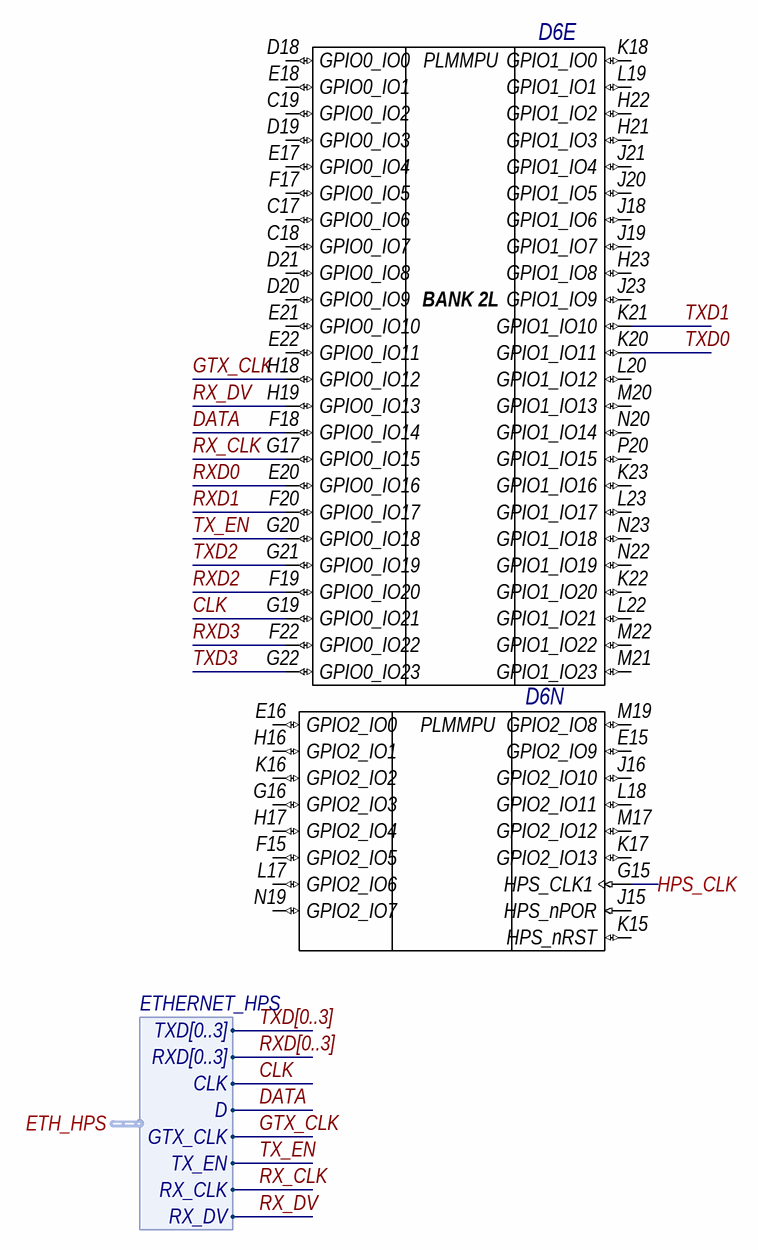
[diagram p44: P_ETH_HPS.SchDoc]

### Parts
D6  10AS066N3F40E2SGE2  [ALTR-FBGA1517_A-350]  (value not drawn)  (parts E,N of 39)

### Ports
ETH_HPS (harness ETHERNET_HPS), HPS_CLK

### Harnesses
ETHERNET_HPS: TXD[0..3], RXD[0..3], CLK, D, GTX_CLK, TX_EN, RX_CLK, RX_DV

### Nets
CLK: D6.G19(GPIO0_IO21) ; port ETH_HPS.CLK
DATA: D6.F18(GPIO0_IO14) ; port ETH_HPS.D
GTX_CLK: D6.H18(GPIO0_IO12) ; port ETH_HPS.GTX_CLK
RX_CLK: D6.G17(GPIO0_IO15) ; port ETH_HPS.RX_CLK
RX_DV: D6.H19(GPIO0_IO13) ; port ETH_HPS.RX_DV
RXD0: D6.E20(GPIO0_IO16)  [project net RXD0_21]
RXD1: D6.F20(GPIO0_IO17)  [project net RXD1_21]
RXD2: D6.F19(GPIO0_IO20)  [project net RXD2_21]
RXD3: D6.F22(GPIO0_IO22)  [project net RXD3_21]
TX_EN: D6.G20(GPIO0_IO18) ; port ETH_HPS.TX_EN
TXD0: D6.K20(GPIO1_IO11)  [project net TXD0_21]
TXD1: D6.K21(GPIO1_IO10)  [project net TXD1_21]
TXD2: D6.G21(GPIO0_IO19)  [project net TXD2_21]
TXD3: D6.G22(GPIO0_IO23)  [project net TXD3_21]
NetD6_G15: D6.G15(HPS_CLK1) ; port HPS_CLK

Not connected (* = marked no-connect by the designer): D6 C17(GPIO0_IO6) C18(GPIO0_IO7) C19(GPIO0_IO2) D18(GPIO0_IO0) D19(GPIO0_IO3) D20(GPIO0_IO9) D21(GPIO0_IO8) E15(GPIO2_IO9) E16(GPIO2_IO0) E17(GPIO0_IO4) E18(GPIO0_IO1) E21(GPIO0_IO10) E22(GPIO0_IO11) F15(GPIO2_IO5) F17(GPIO0_IO5) G16(GPIO2_IO3) H16(GPIO2_IO1) H17(GPIO2_IO4) H21(GPIO1_IO3) H22(GPIO1_IO2) H23(GPIO1_IO8) J15(HPS_nPOR) J16(GPIO2_IO10) J18(GPIO1_IO6) J19(GPIO1_IO7) J20(GPIO1_IO5) J21(GPIO1_IO4) J23(GPIO1_IO9) K15(HPS_nRST) K16(GPIO2_IO2) K17(GPIO2_IO13) K18(GPIO1_IO0) K22(GPIO1_IO20) K23(GPIO1_IO16) L17(GPIO2_IO6) L18(GPIO2_IO11) L19(GPIO1_IO1) L20(GPIO1_IO12) L22(GPIO1_IO21) L23(GPIO1_IO17) M17(GPIO2_IO12) M19(GPIO2_IO8) M20(GPIO1_IO13) M21(GPIO1_IO23) M22(GPIO1_IO22) N19(GPIO2_IO7) N20(GPIO1_IO14) N22(GPIO1_IO19) N23(GPIO1_IO18) P20(GPIO1_IO15)

### Buses and harness runs
bus RXD[0..3]
bus TXD[0..3]

### Notes on the sheet
- Подп. дата
- Инв. № дубл.
- Взам. инв. №
- Подп. и дата
- Инв. № подл.
- Изм.
- Лист
- № докум.
- Подп.
- Дата
- Файл:
- ALTIUM GOSTBOM2.0 KEV
- Копировал
- Формат А4
- (in symbol E105, part E) PLMMPU; BANK 2L
- (in symbol E105, part N) PLMMPU

### Library data of the parts
D6 = E105: as D6 on sheet P_JTAG_EEPROM; UID: E105; Component Kind: Standard; ComponentLink1Description: Manufacturer URL; ComponentLink1URL: https://www.altera.com/; ComponentLink2Description: Datasheet; ComponentLink2URL: https://www.altera.com/content/dam/altera-www/global/en_US/pdfs/literature/hb/arria-10/a10_datasheet.pdf; DatasheetVersion: Rev. 2016-06-24, 06/2016; Mounting Technology: Surface Mount; PackageDescription: 1517-Pin FineLine Ball-Grid Array (FBGA), Body 40 x 40 mm, Pitch 1 mm; PartNumber: 10AS066N3F40E2SGE2; Code_JEDEC: MS-034; ComponentLink3Description: Package Specification; ComponentLink3URL: https://www.altera.com/content/dam/altera-www/global/en_US/pdfs/literature/packaging/04r00461-04.pdf; PackageVersion: Rev. 5.0, 01/2016

## Nets that join several sheets
GND: DRAM DDR4 bank 1 Connector (106 pins), DRAM DDR4 (60 pins), DRAM DDR4 Bank 2 Connector (106 pins), Converter 12V-3V3 (59 pins), Converter 12V-0V9 (61 pins), Converter 12V-5V (11 pins), Supply Switches 12V 3V3 1V8 (13 pins), Supply Driver 12V (13 pins), Supply Swithes 2V5-1V8 (7 pins), Converter 3V3-1V8 (15 pins), Converter 3V3-0V9 V1 (14 pins), Converter 3V3-2V5 (11 pins), Converter 3V3-1V (15 pins), Converter 3V3-VADJ (14 pins), Converter 3V3-DDR4VCC (14 pins), Supply Switches for 3V3 externals (R272.1 R275.1 R276.1), Converter 3V3-0V9 V2 (11 pins), A2/AB19 (36 pins), A2/AB19/AC1 (AC1X4.10 AC1X4.S1 AC1X4.S2), Ethernet HPS Interface (33 pins), Ethernet HPS Connector (6 pins), A2/AB20 (36 pins), A2/AB20/AC1 (AC2X4.10 AC2X4.S1 AC2X4.S2), JTAG Connector (R22.1 XP3.10), miniPCIE Connector (18 pins), PCIE Connector (50 pins), Clock group (70 pins), Display Port Interface (15 pins), DisplayPort Connector (5 pins), A10/AB17 (31 pins), A10/AB18 (31 pins), USB3 Interface (20 pins), USB3 Connector (XS6.10 XS6.11), Core Supply Filter (132 pins), IO Supply Filter (91 pins), P_RAM_aux (R63.1), P_DP_REFCLK_SFP (14 pins), P_JTAG_EEPROM (7 pins), P_PCIE_ETH (8 pins)
3V3: Converter 12V-3V3 (34 pins), Supply Switches 12V 3V3 1V8 (8 pins), Converter 3V3-1V8 (19 pins), Converter 3V3-2V5 (7 pins), Supply Switches for 3V3 externals (14 pins), JTAG Connector (R19.2 R20.1 R21.1 XP3.4), miniPCIE Connector (C69.2 C70.1 XS1.2 XS1.52)
3V3_OUTPUT: Supply Switches 12V 3V3 1V8 (VT4.1 VT4.2 VT4.3), Converter 3V3-0V9 V1 (14 pins), Converter 3V3-1V (18 pins), Converter 3V3-VADJ (15 pins), Converter 3V3-DDR4VCC (14 pins), Converter 3V3-0V9 V2 (6 pins)
12V_INPUT: Converter 12V-3V3 (21 pins), Converter 12V-5V (F1.2), Supply Switches 12V 3V3 1V8 (8 pins), Supply Driver 12V (18 pins), Supply Swithes 2V5-1V8 (R304.2 R307.2 R308.2 R312.2)
12V_OUTPUT: Converter 12V-0V9 (21 pins), Supply Switches 12V 3V3 1V8 (5 pins)
aux_12V: Supply Driver 12V (VT16.5 VT16.6 VT16.7 VT16.8), PCIE Connector (11 pins)
DDR4VCC: DRAM DDR4 bank 1 Connector (25 pins), DRAM DDR4 (72 pins), DRAM DDR4 Bank 2 Connector (25 pins), Converter 3V3-DDR4VCC (R198.1 R199.2)
DL0_N_AB19: A2/AB19 (AB1D12.A17 AB1R104.1), A2/AB19/AC1 (AC1X4.2)
DL0_N_AB20: A2/AB20 (AB2D12.A17 AB2R104.1), A2/AB20/AC1 (AC2X4.2)
DL0_P_AB19: A2/AB19 (AB1D12.A16 AB1R103.1), A2/AB19/AC1 (AC1X4.1)
DL0_P_AB20: A2/AB20 (AB2D12.A16 AB2R103.1), A2/AB20/AC1 (AC2X4.1)
DL1_N_AB19: A2/AB19 (AB1D12.B16 AB1R108.1), A2/AB19/AC1 (AC1X4.4)
DL1_N_AB20: A2/AB20 (AB2D12.B16 AB2R108.1), A2/AB20/AC1 (AC2X4.4)
DL1_P_AB19: A2/AB19 (AB1D12.A18 AB1R106.1), A2/AB19/AC1 (AC1X4.3)
DL1_P_AB20: A2/AB20 (AB2D12.A18 AB2R106.1), A2/AB20/AC1 (AC2X4.3)
DL2_N_AB19: A2/AB19 (AB1D12.A22 AB1R111.1), A2/AB19/AC1 (AC1X4.6)
DL2_N_AB20: A2/AB20 (AB2D12.A22 AB2R111.1), A2/AB20/AC1 (AC2X4.6)
DL2_P_AB19: A2/AB19 (AB1D12.A21 AB1R110.1), A2/AB19/AC1 (AC1X4.5)
DL2_P_AB20: A2/AB20 (AB2D12.A21 AB2R110.1), A2/AB20/AC1 (AC2X4.5)
DL3_N_AB19: A2/AB19 (AB1D12.A23 AB1R114.1), A2/AB19/AC1 (AC1X4.8)
DL3_N_AB20: A2/AB20 (AB2D12.A23 AB2R114.1), A2/AB20/AC1 (AC2X4.8)
DL3_P_AB19: A2/AB19 (AB1D12.B20 AB1R113.1), A2/AB19/AC1 (AC1X4.7)
DL3_P_AB20: A2/AB20 (AB2D12.B20 AB2R113.1), A2/AB20/AC1 (AC2X4.7)
DP_3V3: Display Port Interface (6 pins), DisplayPort Connector (X1.20)
DP_ML_LANE0_C_N: Display Port Interface (C3.2 D2.3), DisplayPort Connector (X1.3)
DP_ML_LANE0_C_P: Display Port Interface (C2.2 D2.4), DisplayPort Connector (X1.1)
DP_ML_LANE1_C_N: Display Port Interface (C5.2 D2.1), DisplayPort Connector (X1.6)
DP_ML_LANE1_C_P: Display Port Interface (C4.2 D2.2), DisplayPort Connector (X1.4)
DP_ML_LANE2_C_N: Display Port Interface (C7.2 D3.3), DisplayPort Connector (X1.9)
DP_ML_LANE2_C_P: Display Port Interface (C6.2 D3.4), DisplayPort Connector (X1.7)
DP_ML_LANE3_C_N: Display Port Interface (C9.2 D3.1), DisplayPort Connector (X1.12)
DP_ML_LANE3_C_P: Display Port Interface (C8.2 D3.2), DisplayPort Connector (X1.10)
EXT_SDA: PCIE Connector (XS2.B6), A10/AB17 (AB1X2.4)
GND_DP: Display Port Interface (C13.2 R4.2), DisplayPort Connector (X1.21 X1.22 X1.23 X1.24)
HLVDDI_N: Converter 3V3-1V (C470.1 R210.1), Converter 3V3-DDR4VCC (C460.1 R199.1)
HLVDDI_P: Converter 3V3-1V (C470.2 R212.1), Converter 3V3-DDR4VCC (C460.2 R197.1)
IO_1V8: Supply Swithes 2V5-1V8 (VT23.1 VT23.2 VT23.3), Ethernet HPS Interface (11 pins), Clock group (9 pins), USB3 Interface (11 pins)
IO_2V5: DRAM DDR4 bank 1 Connector (R85.1 XS3.255 XS3.257 XS3.259), DRAM DDR4 (6 pins), DRAM DDR4 Bank 2 Connector (R90.1 XS4.255 XS4.257 XS4.259), Supply Swithes 2V5-1V8 (VT21.5 VT21.6 VT21.7 VT21.8), A2/AB19 (39 pins), A2/AB19/AC1 (AC1X4.9), Ethernet HPS Interface (7 pins), A2/AB20 (39 pins), A2/AB20/AC1 (AC2X4.9), Clock group (9 pins), USB3 Interface (G1.4)
IO_3V3: Supply Switches for 3V3 externals (VT10.5 VT10.6 VT10.7 VT10.8), Ethernet HPS Interface (C402.2 C404.2 L12.1), Ethernet HPS Connector (R314.1 R315.1), Clock group (C32.2 C36.2 G3.1 G3.10), Display Port Interface (C1.1 D1.5 R2.2), A10/AB17 (AB1C370.2 AB1C371.2 AB1L9.1 AB1L10.1), A10/AB18 (AB2C370.2 AB2C371.2 AB2L9.1 AB2L10.1), USB3 Interface (6 pins)
IO_5V: Converter 12V-5V (11 pins), A2/AB19 (AB1C379.2 AB1D11.1), Ethernet HPS Interface (C403.2 D13.5), A2/AB20 (AB2C379.2 AB2D11.1)
NetC437_2: Supply Switches 12V 3V3 1V8 (5 pins), Supply Swithes 2V5-1V8 (8 pins)
NetC537_2: Supply Swithes 2V5-1V8 (5 pins), Converter 3V3-2V5 (R256.2 R257.2)
NetD14_15: Ethernet HPS Interface (D14.15 R133.1), Ethernet HPS Connector (X5.17)
NetD14_17: Ethernet HPS Interface (D14.17 R134.1), Ethernet HPS Connector (X5.13)
NetD15_D6: Converter 12V-3V3 (D15.D6 R150.1), Converter 12V-0V9 (D24.D6)
NetD15_E5: Converter 12V-3V3 (D15.E5 R151.1), Converter 12V-0V9 (D24.E5)
NetD15_E6: Converter 12V-3V3 (D15.E6 R149.1), Converter 12V-0V9 (D24.E6)
NetR3_2: Display Port Interface (R3.2), DisplayPort Connector (X1.13)
NetR5_2: Display Port Interface (R5.2), DisplayPort Connector (X1.19)
NetR6_2: Display Port Interface (R6.2), DisplayPort Connector (X1.14)
NetR7_2: Display Port Interface (R7.2), DisplayPort Connector (X1.18)
NetR188_2: Supply Swithes 2V5-1V8 (R305.2 VT17.1), Converter 3V3-DDR4VCC (R188.2), Supply Switches for 3V3 externals (VT8.1)
NetR213_2: Converter 3V3-0V9 V1 (R213.2), Converter 3V3-0V9 V2 (R228.1)
NetR248_1: Supply Switches 12V 3V3 1V8 (VT1.5 VT1.6 VT1.7 VT1.8), Converter 3V3-1V8 (R248.1 R249.2)
NetR278_1: Supply Driver 12V (R278.1), Supply Switches for 3V3 externals (VT7.1)
PCIE_aux3V3: Supply Switches for 3V3 externals (VT11.5 VT11.6 VT11.7 VT11.8), PCIE Connector (C73.2 XS2.B10)
PCIE_DC_3V3: Supply Switches for 3V3 externals (R277.1), PCIE Connector (7 pins)
TRD1_N: Ethernet HPS Interface (D14.3), Ethernet HPS Connector (X5.10)
TRD1_P: Ethernet HPS Interface (D14.2), Ethernet HPS Connector (X5.11)
TRD2_N: Ethernet HPS Interface (D14.6), Ethernet HPS Connector (X5.5)
TRD2_P: Ethernet HPS Interface (D14.5), Ethernet HPS Connector (X5.4)
TRD3_N: Ethernet HPS Interface (D14.8), Ethernet HPS Connector (X5.2)
TRD3_P: Ethernet HPS Interface (D14.7), Ethernet HPS Connector (X5.3)
TRD4_N: Ethernet HPS Interface (D14.11), Ethernet HPS Connector (X5.9)
TRD4_P: Ethernet HPS Interface (D14.10), Ethernet HPS Connector (X5.8)